# EAGLE design source_eagle (EAGLE 9.6.2)
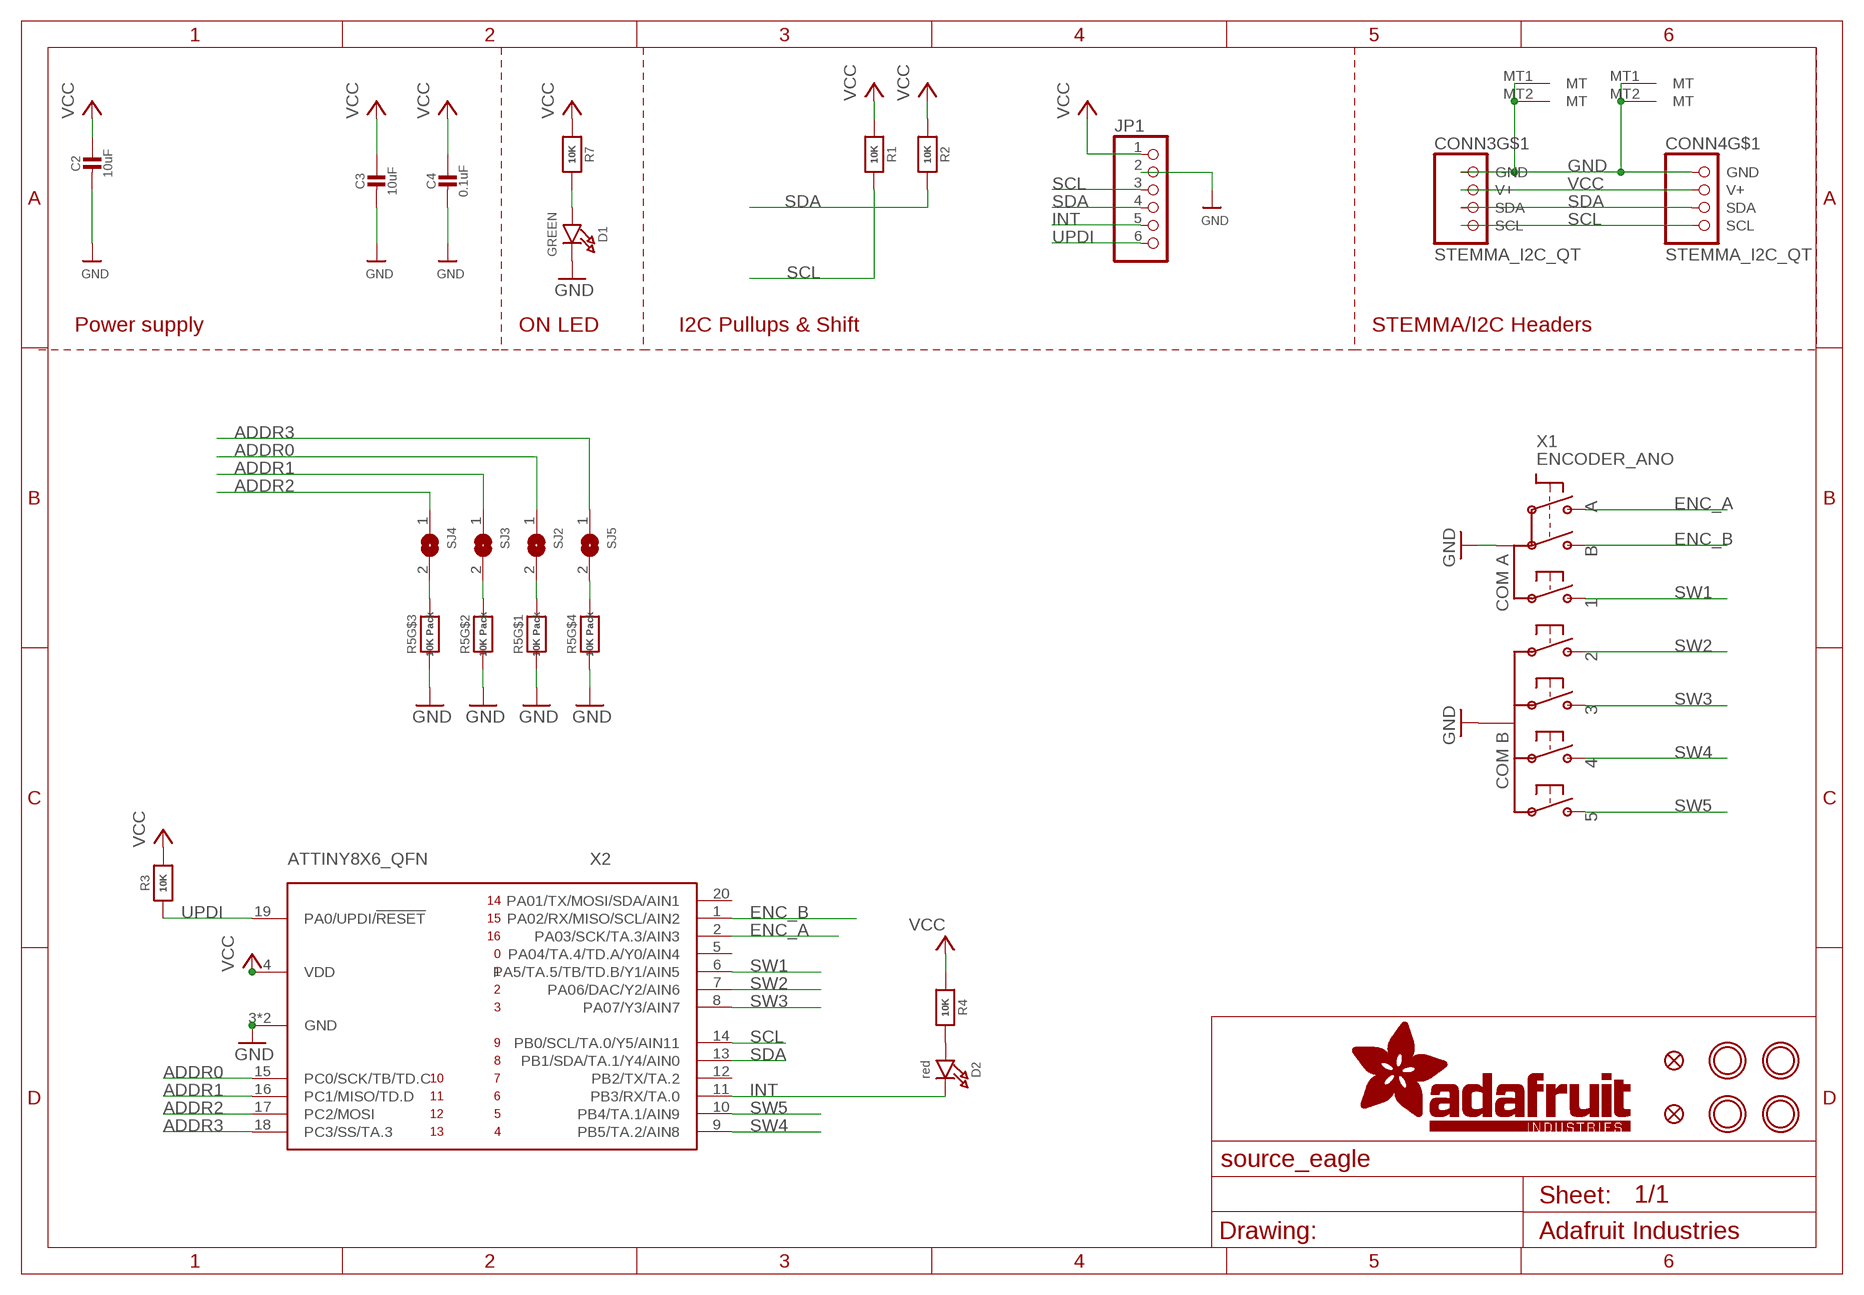
[diagram p0: schematic, sheet 1]

## Parts
C2  10uF  CAP_CERAMIC0805-NOOUTLINE  [0805-NO]
C3  10uF  CAP_CERAMIC0805-NOOUTLINE  [0805-NO]
C4  0.1uF  CAP_CERAMIC0603_NO  [0603-NO]
CONN3  STEMMA_I2C_QT  [JST_SH4]
CONN4  STEMMA_I2C_QT  [JST_SH4]
D1  GREEN  LED0603_NOOUTLINE  [CHIPLED_0603_NOOUTLINE]
D2  red  LED0603_NOOUTLINE  [CHIPLED_0603_NOOUTLINE]
FID3  FIDUCIAL_1MM  [FIDUCIAL_1MM]
FID4  FIDUCIAL_1MM  [FIDUCIAL_1MM]
JP1  HEADER-1X670MIL  [1X06_ROUND_70]
R1  10K  RESISTOR_0603_NOOUT  [0603-NO]
R2  10K  RESISTOR_0603_NOOUT  [0603-NO]
R3  10K  RESISTOR_0603_NOOUT  [0603-NO]
R4  10K  RESISTOR_0603_NOOUT  [0603-NO]
R5  10K Pack  RESISTOR_4PACK  [RESPACK_4X0603]
R7  10K  RESISTOR_0603_NOOUT  [0603-NO]
SJ2  SOLDERJUMPERCLOSED  [SOLDERJUMPER_CLOSEDWIRE]
SJ3  SOLDERJUMPERCLOSED  [SOLDERJUMPER_CLOSEDWIRE]
SJ4  SOLDERJUMPERCLOSED  [SOLDERJUMPER_CLOSEDWIRE]
SJ5  SOLDERJUMPERCLOSED  [SOLDERJUMPER_CLOSEDWIRE]
U$25  MOUNTINGHOLE2.5  [MOUNTINGHOLE_2.5_PLATED]
U$27  MOUNTINGHOLE2.5  [MOUNTINGHOLE_2.5_PLATED]
U$29  MOUNTINGHOLE2.5  [MOUNTINGHOLE_2.5_PLATED]
U$30  MOUNTINGHOLE2.5  [MOUNTINGHOLE_2.5_PLATED]
X1  ENCODER_ANO  [ENCODER_ANO]
X2  ATTINY8X6_QFN  [QFN20_3MM]

## Nets
ADDR0: SJ2.1 X2.15(PC0/SCK/TB/TD.C)
ADDR1: SJ3.1 X2.16(PC1/MISO/TD.D)
ADDR2: SJ4.1 X2.17(PC2/MOSI)
ADDR3: SJ5.1 X2.18(PC3/SS/TA.3)
ENC_A: X1.A X2.2(PA03/SCK/TA.3/AIN3)
ENC_B: X1.B X2.1(PA02/RX/MISO/SCL/AIN2)
GND: C2.2 C3.2 C4.2 CONN3.1(GND) CONN3.MT1(MT) CONN3.MT2(MT) CONN4.1(GND) CONN4.MT1(MT) CONN4.MT2(MT) D1.C JP1.2 R5.1 R5.2 R5.3 R5.4 X1.COM_A(COMA) X1.COM_B X2.3(GND) X2.PAD(GND)
INT: D2.C JP1.5 X2.11(PB3/RX/TA.0)
N$1: D1.A R7.2
N$2: D2.A R4.2
N$3: R5.8 SJ2.2
N$4: R5.7 SJ3.2
N$5: R5.6 SJ4.2
N$6: R5.5 SJ5.2
SCL: CONN3.4(SCL) CONN4.4(SCL) JP1.3 R1.2 X2.14(PB0/SCL/TA.0/Y5/AIN11)
SDA: CONN3.3(SDA) CONN4.3(SDA) JP1.4 R2.2 X2.13(PB1/SDA/TA.1/Y4/AIN0)
SW1: X1.S1 X2.6(PA5/TA.5/TB/TD.B/Y1/AIN5)
SW2: X1.S2 X2.7(PA06/DAC/Y2/AIN6)
SW3: X1.S3 X2.8(PA07/Y3/AIN7)
SW4: X1.S4 X2.9(PB5/TA.2/AIN8)
SW5: X1.S5 X2.10(PB4/TA.1/AIN9)
UPDI: JP1.6 R3.1 X2.19(PA0/UPDI/!RESET)
VCC: C2.1 C3.1 C4.1 CONN3.2(V+) CONN4.2(V+) JP1.1 R1.1 R2.1 R3.2 R4.1 R7.1 X2.4(VDD)
Unconnected: X2.5(PA04/TA.4/TD.A/Y0/AIN4) X2.12(PB2/TX/TA.2) X2.20(PA01/TX/MOSI/SDA/AIN1)

## Notes on the sheet
- Power supply | ON LED | I2C Pullups & Shift | STEMMA/I2C Headers

## Library data of the parts
C2-C4 = microbuilder:CAP_CERAMIC: Ceramic Capacitors For new designs, use the packages preceded by an '_' character since they are more reliable: The following footprints should be used on most boards: _0402 - Standard footprint for regular board layouts _0603 - Standard footprint for regular board layouts _0805 - Standard footprint for regular board layouts _1206 - Standard footprint for regular board layouts For extremely tight-pitch boards where space is at a premium, the following 'micro-pitch' footprints can be used (smaller pads, no silkscreen outline, etc.): _0402MP - Micro-pitch footprint for very dense/compact boards _0603MP - Micro-pitch footprint for very dense/compact boards _0805MP - Micro-pitch footprint for very dense/compact boards _1206MP - Micro-pitch footprint for very dense/compact boards
CONN3 CONN4 = adafruit_electromech:STEMMA_I2C; LCSC: C2845363
D1 D2 = microbuilder:LED: LED 0603 - 0603 Surface Mount Package 2mA: Green LED - Low Power (3.9mcd, 2ma, 1.7Vf) - Digikey: 475-2709-2-ND Orange LED - Low Power (9.8mcd, 2ma, 1.8Vf) - Digikey: 475-1194-2-ND Red LED - Low Power (5mcd, 2ma, 1.8Vf) - Digikey: 475-1195-2-ND Yellow LED - Low Power (7mcd, 2ma, 1.8Vf) - Digikey: 475-1196-2-ND 5mA: Blue LED - Low Power (17mcd, 5ma, 2.9Vf) - Digikey: LNJ937W8CRACT-ND 0805 - 0805 Surface Mount Package 2mA: Red LED (8.8mcd, 2mA, 1.8Vf, Clear) - Low Power [Digikey: 475-2510-1-ND] Green LED (5mcd, 2mA, 1.8Vf, Clear) - Low Power [Digikey: 475-2730-1-ND] Yellow LED (11.3mcd, 2mA, 1.8Vf, Clear) - Low Power [Digikey: 475-2555-1-ND] 20mA: Red LED (104mcd, 20mA, Diffused) - LS R976 [Digikey: 475-1278-6-ND] Red LED (12mcd, 20mA, 2.0Vf, Clear) - APT2012EC [Digikey: 754-1128-1-ND] Green LED (15mcd, 20mA, 2.2Vf, Clear) - APT2012GC [Digikey: 754-1131-1-ND] Orange LED (160mcd, 20mA, 2.1Vf, Clear) - APT2012SECK [Digikey: 754-1130-1-ND] 1206 - 1206 Surface Mount Package Green LED (26mcd, 20mA, Diffused) - LG N971 [Digikey: 475-1407-6-ND] Red LED (15mcd, 20mA, Diffused) - LH N974 [Digikey: 475-1416-6-ND] Cree - Cree High-Power Surface Mount LEDs XPEBWT-L1-0000-00D50 - White 111lm 350mA 2.9Vf 6200K 110° XTEAWT-00-0000-00000LEE3 - White 114lm 350mA 2.85Vf 5000K 115° Everlight - Everlight 45-21 Series Surface Mount LEDs 45-21/QK2C-B2832AC2CB2/2T - Warm White 2000mcd 20mA 3.25Vf 3050K 120° 45-21/LK2C-B38452C4CB2/2T - Nuetral White 2000mcd 20mA 3.25Vf 4150K 120° 45-21/LK2C-B50634C6CB2/2T - Cold White 2200mcd 20mA 3.25Vf 5650K 120° PLCC2 Reverse Mount LS T77K-J1L2-1-0-2-R18-Z - Red 11.25mcd 2mA 1.8Vf 630nm 120° LO T77K-L1M2-24-Z - Orange 19.6mcd 2mA 1.8Vf 606nm 120° LY T77K-K2M1-26-Z - Yellow 15.7mcd 2mA 1.8Vf 587nm 120°; ROT: 270
FID3 FID4 = microbuilder:FIDUCIAL: Fiducial Alignment Points Various fiducial points for machine vision alignment.; BOM: EXCLUDE
JP1 = microbuilder:HEADER-1X6: PIN HEADER
R1-R4 R7 = microbuilder:RESISTOR: Resistors For new designs, use the packages preceded by an '_' character since they are more reliable: The following footprints should be used on most boards: _0402 - Standard footprint for regular board layouts _0603 - Standard footprint for regular board layouts _0805 - Standard footprint for regular board layouts _1206 - Standard footprint for regular board layouts For extremely tight-pitch boards where space is at a premium, the following 'micro-pitch' footprints can be used (smaller pads, no silkscreen outline, etc.): _0402MP - Micro-pitch footprint for very dense/compact boards _0603MP - Micro-pitch footprint for very dense/compact boards _0805MP - Micro-pitch footprint for very dense/compact boards _1206MP - Micro-pitch footprint for very dense/compact boards
R5 = microbuilder:RESISTOR_4PACK: Resistor Packs (4 resistors) 4 x 0603 10K 1/16W - Digikey: YC164J-10KCT-ND
SJ2-SJ5 = microbuilder:SOLDERJUMPER: SMD Solder JUMPER Solder the two pads together to create a connection, or remove the solder to break it. REFLOW - Use this footprint for solder paste and reflow ovens. WAVE - Use this footprint for hand-soldering (larger pads). CLOSED - Has a trace between the two pads to ensure it is closed by default. The trace needs to be cut to disable the jumper, and can be closed again by creating a solder bridge between the two pads.
U$25 U$27 U$29 U$30 = adafruit_electromech:MOUNTINGHOLE: Mounting Hole For #2 screws (0.086"/2.18mm width, 0.094"/2.4mm hole) use 2.5mm; BOM: EXCLUDE
X1 = adafruit_electromech:ENCODER_ANO
X2 = adafruit_micro:ATTINY8X6

## Net classes
1 highpower: width 0.406 mm, drill 0.483 mm
2 lowpower: width 0.305 mm, drill 0.483 mm

## Board
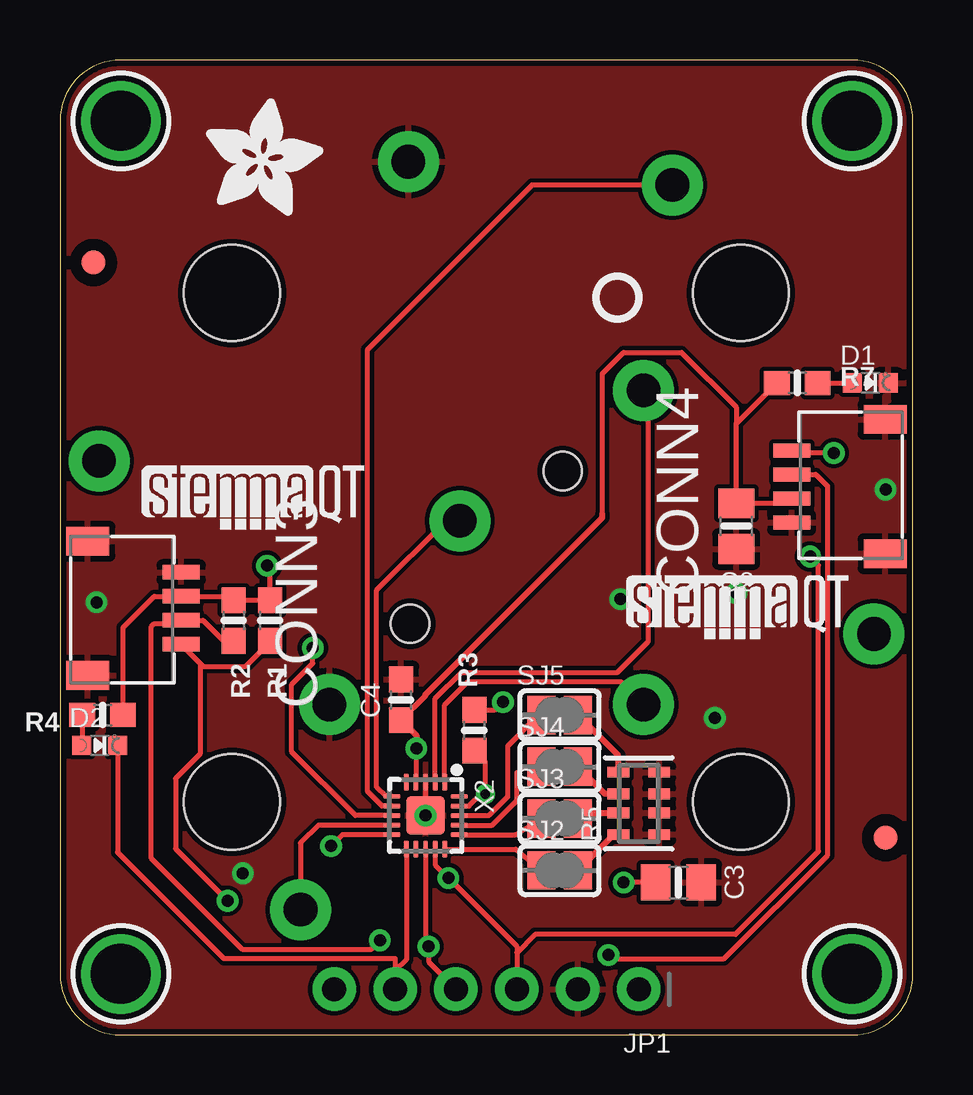
[diagram p1: board, top side]
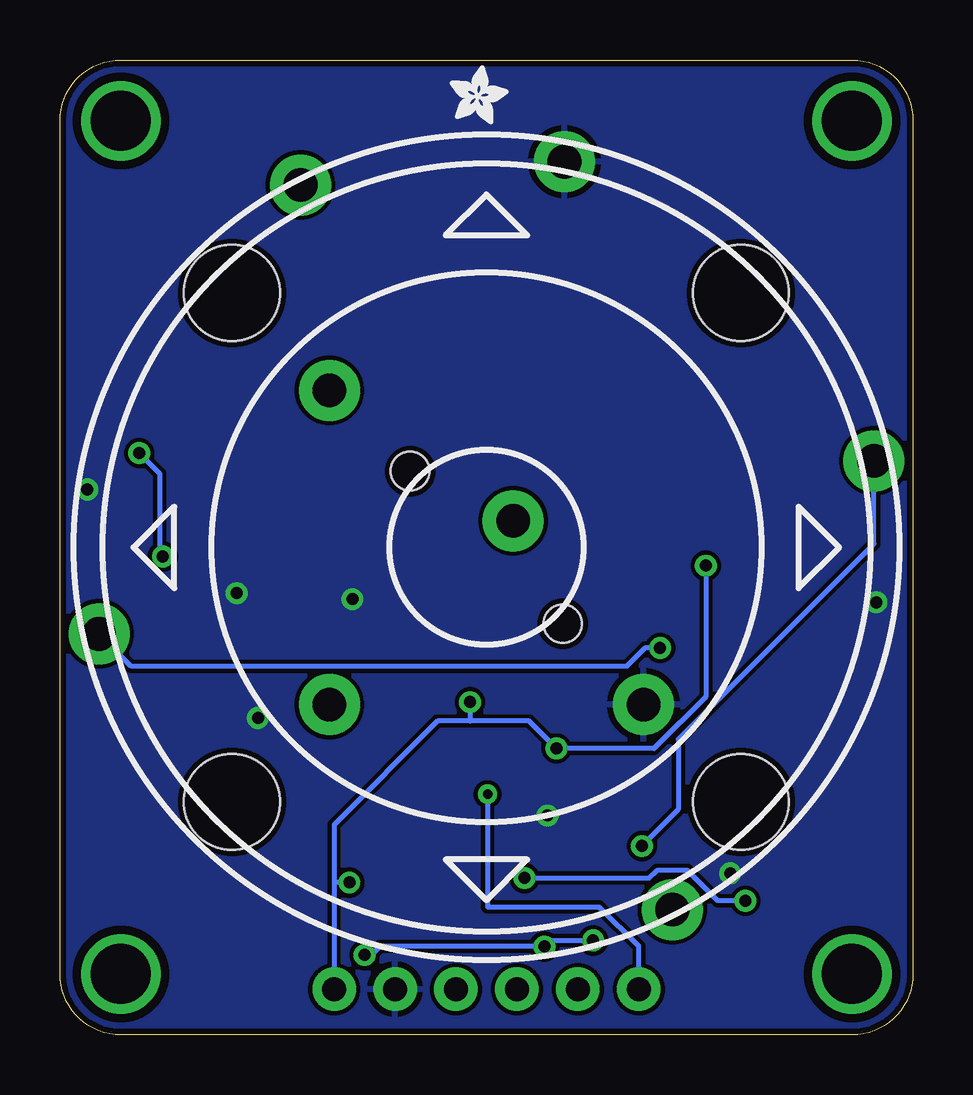
[diagram p2: board, bottom side, seen from below]

Size 35.56 x 40.64 mm. Coordinates in mm from the lower left corner, seen from the top.
Outline: 35.56,2.54 35.56,38.1 arc90 33.02,40.64 2.54,40.64 arc90 0,38.1 0,2.54 arc90 2.54,0 33.02,0 arc90 35.56,2.54
Copper layers (1*16): Top 0.035mm / dielectric 1.5mm / Bottom 0.035mm
Design rules "adafruit 7-7 *": minimum track width 7mil, minimum drill 15.5mil, track to track 7mil, track to pad 7mil, pad to pad 7mil, via to via 7mil, smd to smd 7mil, copper to edge 10mil, drill to drill 8mil, minimum pad ring 16mil, minimum via ring 8mil, stop-mask expansion 2mil, vias tented up to drill 20mil, thermal gap 10mil

### Footprints (pad centres in the part's own frame; a part is rotated, then mirrored left to right if it is on the bottom)
0805-NO = smd 1.24 x 1.5: 1 -0.95,0; 2 0.95,0
0603-NO = smd 1.075 x 1: 1 -0.85,0; 2 0.85,0
JST_SH4 = smd 0.6 x 1.55: 1 -1.5,2.006; 2 -0.5,2.006; 3 0.5,2.006; 4 1.5,2.006 | smd 1.2 x 1.8: MT1 -2.8,-1.894; MT2 2.8,-1.894
CHIPLED_0603_NOOUTLINE = smd 0.8 x 0.8: A 0,-0.75; C 0,0.75
FIDUCIAL_1MM = smd 1 x 1: 1 0,0
1X06_ROUND_70 = drill 1 pad 1.778: 1 -6.35,0; 2 -3.81,0; 3 -1.27,0; 4 1.27,0; 5 3.81,0; 6 6.35,0
RESPACK_4X0603 = smd 0.45 x 0.9: 1 -1.3,-0.85; 2 -0.4,-0.85; 3 0.4,-0.85; 4 1.3,-0.85; 5 1.3,0.85; 6 0.4,0.85; 7 -0.4,0.85; 8 -1.3,0.85
SOLDERJUMPER_CLOSEDWIRE = smd 1.168 x 1.6: 1 -0.762,0; 2 0.762,0 | smd 0.635 x 0.203: WIRE 0,0
MOUNTINGHOLE_2.5_PLATED = drill 2.5 pad 3.2: P$1 0,0
ENCODER_ANO = drill 1.4 pad 2.54: A 0,-9.26; B 9.26,0; COM_A 0,9.26; COM_B -13.67,-9.07; S1 -1.57,0; S2 -5.2,-16.16; S3 13.97,-8.87; S4 5.2,16.16; S5 -13.97,8.87 | hole 1.6: 0,4.5; 0,-4.5 | hole 4: 0,15; 0,-15; -15,0; 15,0
QFN20_3MM = smd 0.7 x 0.2: 1 -1.4,0.8; 2 -1.4,0.4; 3 -1.4,0; 4 -1.4,-0.4; 5 -1.4,-0.8; 11 1.4,-0.8; 12 1.4,-0.4; 13 1.4,0; 14 1.4,0.4; 15 1.4,0.8 | smd 0.2 x 0.7: 6 -0.8,-1.4; 7 -0.4,-1.4; 8 0,-1.4; 9 0.4,-1.4; 10 0.8,-1.4; 16 0.8,1.4; 17 0.4,1.4; 18 0,1.4; 19 -0.4,1.4; 20 -0.8,1.4 | smd 1.6 x 1.6: PAD 0,0

### Placement (x,y rotation side)
C2  28.19,21.21 270 top
C3  25.78,6.35 0 top
C4  14.22,13.97 90 top
CONN3  3.05,17.78 270 top
CONN4  32.51,22.86 90 top
D1  33.78,27.18 270 top
D2  1.65,12.06 270 top
E$2  [ADAFRUIT_2.5MM]  19.3,37.97 0 bottom
FID3  1.4,32.19 180 top
FID4  34.42,8.22 180 top
JP1  17.78,1.91 180 top
PLABEL0  [PLABEL0]  18.49,7.01 90 top
PLABEL1  [PLABEL1]  18.49,9.27 90 top
PLABEL2  [PLABEL2]  24.13,4.32 90 top
PLABEL3  [PLABEL3]  8.89,1.91 0 top
PLABEL4  [PLABEL4]  21.46,4.32 90 top
PLABEL5  [PLABEL5]  19.05,4.45 90 top
PLABEL6  [PLABEL6]  16.51,4.32 90 top
PLABEL7  [PLABEL7]  13.97,4.19 90 top
PLABEL8  [PLABEL8]  15.11,29.84 0 top
PLABEL9  [PLABEL9]  33.15,28.07 0 top
PLABEL10  [PLABEL10]  18.49,11.43 90 top
PLABEL11  [PLABEL11]  18.47,13.72 90 top
R1  8.76,17.27 270 top
R2  7.24,17.27 270 top
R3  17.27,12.7 90 top
R4  1.78,13.34 180 top
R5  24.13,9.65 90 top
R7  30.73,27.18 0 top
SJ2  20.83,6.86 0 top
SJ3  20.83,9.02 0 top
SJ4  20.83,11.18 0 top
SJ5  20.83,13.34 0 top
U$2  [ADAFRUIT_5MM]  6.1,34.16 0 top
U$25  33.02,2.54 180 top
U$27  2.54,2.54 180 top
U$29  33.02,38.1 180 top
U$30  2.54,38.1 180 top
U$33  [PCBFEAT-REV-040]  23.24,30.73 180 top
U$34  [STEMMAQT]  3.43,21.08 0 top
U$35  [STEMMAQT]  23.62,16.51 0 top
X1  17.78,20.32 225 bottom
X2  15.24,9.14 270 top

### Tracks (layer width: path | path; a pad name or v marks a point on that pad's centre or on a via)
ADDR0
  Top 0.203: X2.15 19,7.74 SJ2.1
ADDR1
  Top 0.203: X2.16 18.98,8.34 SJ3.1
ADDR2
  Top 0.203: X2.17 18.02,8.74 19.05,9.78 19.05,10.92 19.39,11.18 SJ4.1
ADDR3
  Top 0.203: X2.18 17.88,9.14 18.67,9.94 18.67,12.04 19.89,13.27 SJ5.1
ENC_A
  Top 0.203: X2.2 15.64,14.02 16.73,15.11 23.24,15.11 24.51,16.38 24.51,26.69 X1.A
ENC_B
  Top 0.203: X2.1 16.04,13.75 17.02,14.73 23.37,14.73 X1.B
GND  (via drill 0.5)
  Top 0.203: X2.3 X2.PAD
  other vias: 15.24,9.14 28.19,18.41 27.3,13.21 7.62,6.73 1.52,18.03 34.42,22.73 23.37,18.16
  pour Top: 0,40.64 35.56,40.64 35.56,0 0,0
  pour Bottom: 0,40.64 35.56,40.64 35.56,0 0,0
INT
  Top 0.203: X2.11 14.44,3.14 13.97,2.67 | D2.C 2.4,7.61 6.84,3.18 13.97,3.18 13.97,2.67 | 13.97,2.67 JP1.5
N$1
  Top 0.203: R7.2 D1.A
N$2
  Top 0.203: R4.2 0.93,12.09 D2.A
N$3
  Top 0.254: SJ2.2 23.08,8.35 R5.8
N$4
  Top 0.254: SJ3.2 21.83,9.25 R5.7
N$5
  Top 0.254: R5.6 22.71,10.05 SJ4.2
N$6
  Top 0.254: R5.5 23.28,11.64 SJ5.2
SCL  (via drill 0.5)
  Top 0.203: X2.14 15.64,7.09 v16.19,6.54 19.05,3.68 19.05,3.43 | 19.05,3.43 JP1.3 | CONN3.4 5.84,15.49 | 5.84,15.49 5.97,15.37 7.75,15.37 8.76,16.38 R1.2 | 5.84,15.49 5.84,11.71 4.82,10.69 4.82,7.76 v6.99,5.59 | v31.27,19.94 31.62,19.59 31.62,7.65 28.16,4.19 19.81,4.19 19.05,3.43 | v32.26,24.26 30.1,24.26 CONN4.4
  Bottom 0.203: v6.99,5.59 8.13,5.59 9.4,6.86 10.69,6.86 11,6.54 v16.19,6.54 | v31.27,19.94 31.4,20.07 31.4,23.4 v32.26,24.26
SDA  (via drill 0.5)
  Top 0.203: X2.13 15.24,3.81 v15.37,3.68 15.37,3.05 JP1.4 | CONN3.3 5.21,17.28 | 5.21,17.28 5.96,17.28 6.82,16.42 R2.2 | 5.21,17.28 5.07,17.14 3.94,17.14 3.81,17.02 3.81,7.37 7.62,3.56 12.95,3.56 v13.34,3.94 | CONN4.3 31.5,23.36 32,22.86 32,7.49 27.69,3.18 23.02,3.18 v22.86,3.33
  Bottom 0.203: v13.34,3.94 15.11,3.94 v15.37,3.68 22.23,3.68 22.58,3.33 v22.86,3.33
SW1
  Top 0.203: X2.6 13.59,9.94 13.21,10.32 13.21,18.54 16.1,21.43 X1.S1
SW2
  Top 0.203: X2.7 13.42,9.54 12.83,10.14 12.83,28.58 19.68,35.42 X1.S2
SW3  (via drill 0.5)
  Top 0.203: X2.8 12.32,9.14 9.66,11.8 9.66,14.62 10.54,15.49 v10.54,16.13
  Bottom 0.203: v10.54,16.13 11.18,16.13 11.94,15.37 32.58,15.37 X1.S3
SW4
  Top 0.203: X2.9 10.78,8.74 10.03,8 X1.S4
SW5  (via drill 0.5)
  Top 0.203: X2.10 11.77,8.34 v11.3,7.87
  Bottom 0.203: v11.3,7.87 9.78,9.4 9.78,12.32 1.63,20.47 X1.S5
UPDI  (via drill 0.39)
  Top 0.203: X2.19 17.06,9.54 17.55,10.03 v17.74,10.03 17.74,11.39 R3.1
  Bottom 0.203: v17.74,10.03 17.74,5.33 13.08,5.33 11.43,3.68 JP1.6
VCC  (via drill 0.5)
  Top 0.203: R4.1 2.63,16.98 3.93,18.28 CONN3.2 7.08,18.28 R2.1 R1.1 8.76,19.43 v8.64,19.56 | v14.86,11.94 14.84,11.92 X2.4 | CONN4.2 29.8,22.16 C2.1 28.19,25.49 | 28.19,25.49 R7.1 | 28.19,25.49 28.19,26.16 25.91,28.45 23.5,28.45 22.61,27.56 22.61,21.72 | R3.2 18.14,13.55 v18.46,13.87 | C3.1 v23.5,6.35
  Top 0.254: v14.86,11.94 14.86,12.48 C4.1 15.23,14.13 15.23,14.19 22.61,21.56 22.61,21.72
  Bottom 0.203: 24.13,6.35 24.13,8.76 19.81,13.08 18.46,13.08 | 24.13,6.35 JP1.1 | 18.46,13.08 16,13.08 v14.86,11.94 10.8,11.94 8.64,14.1 v8.64,19.56 | v18.46,13.87 18.46,13.08 | v23.5,6.35 24.13,6.35

### Text on the board
Pinguin_tBackup: ANO / Rotary / Encoder / I2C seesaw | on | A3 | A2 | A1 | A0 | INT | SDA | SCL | GND | VIN | UPDI